# EAGLE board Controller-Board_Rack-PDU_2.1 (EAGLE 9.2.1)
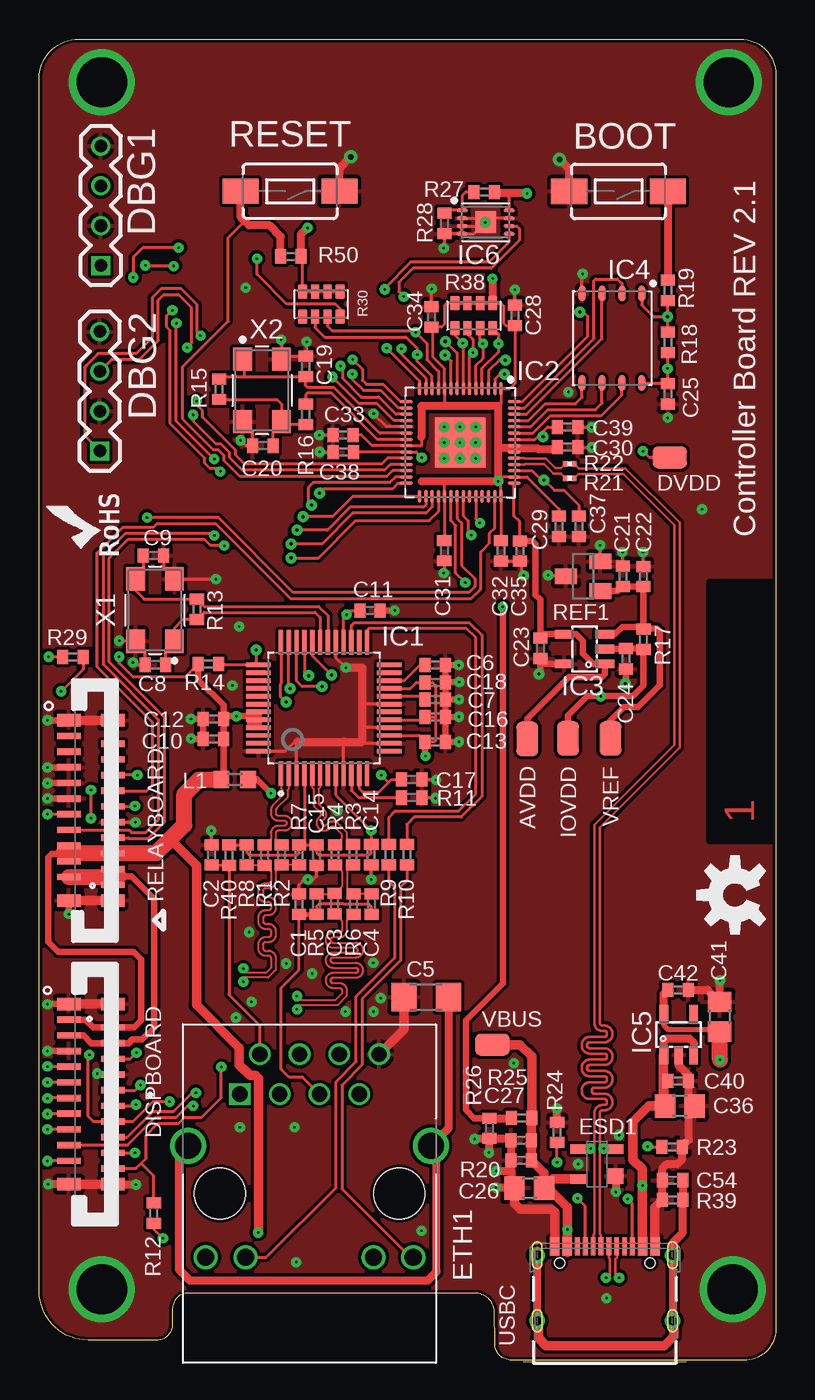
[diagram p2: board, top side]
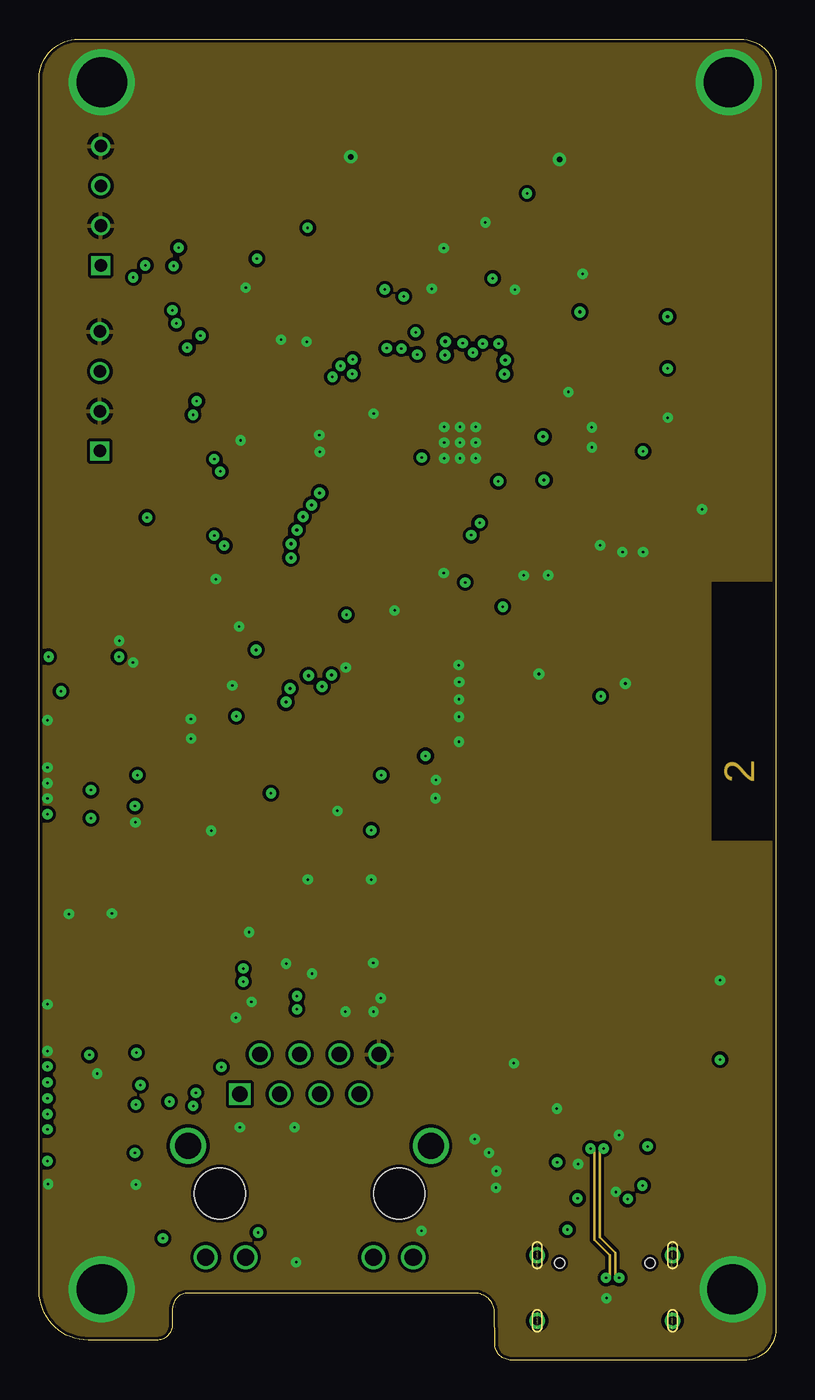
[diagram p3: board, inner layer Route2]
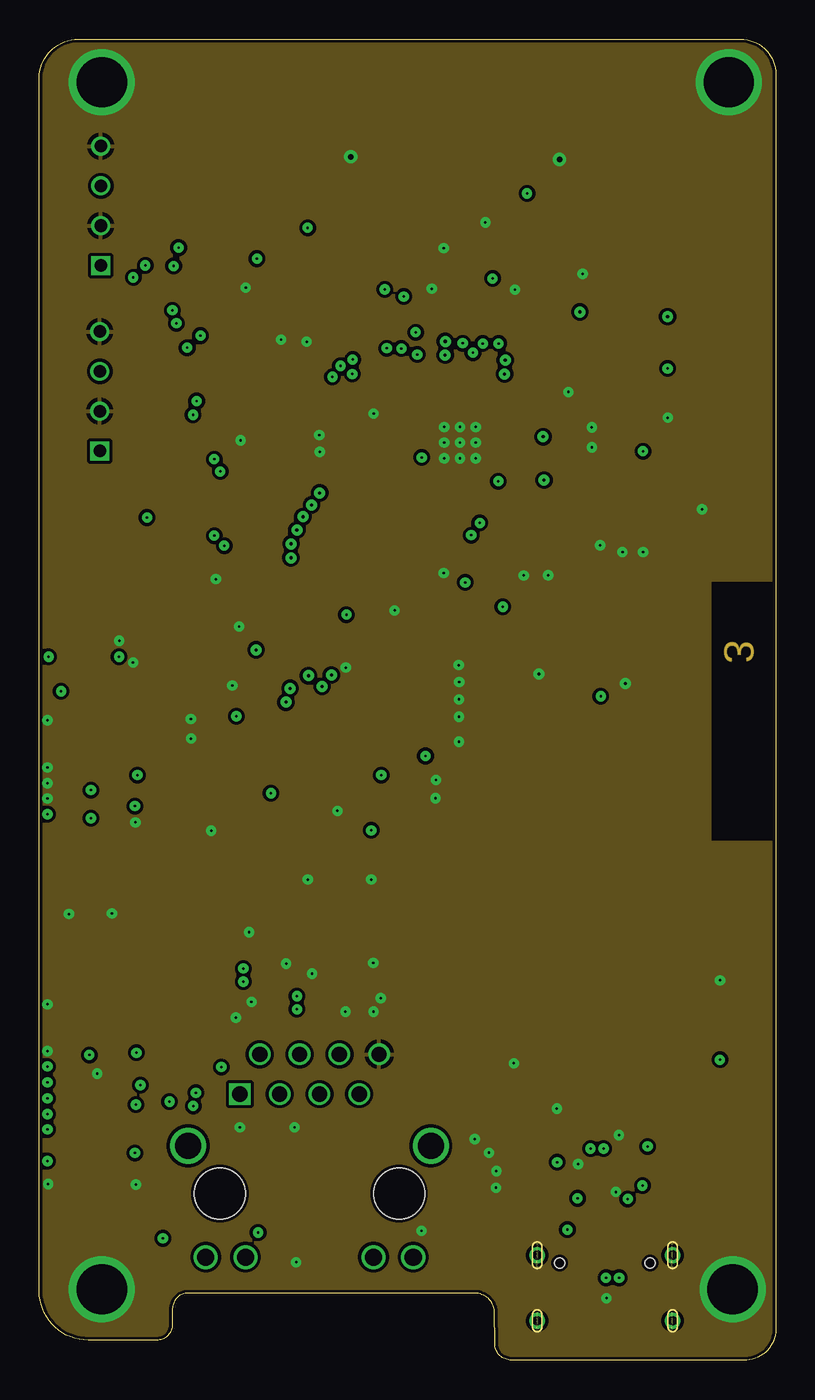
[diagram p4: board, inner layer Route15]
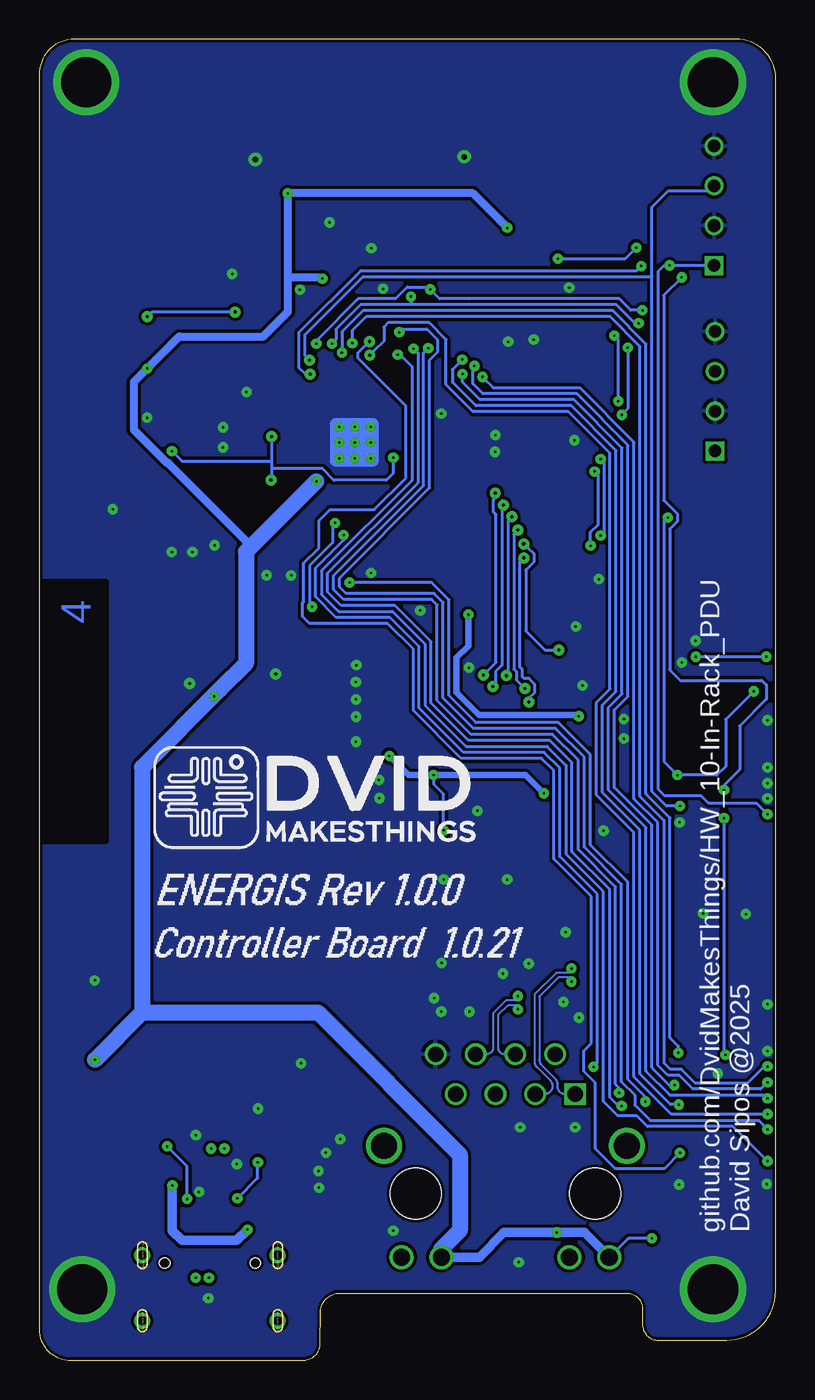
[diagram p5: board, bottom side, seen from below]

Size 47 x 84.28 mm. Coordinates in mm from the lower left corner, seen from the top.
Outline: 0,4.42 0,81.77 arc-90 2.51,84.28 44.76,84.28 arc-90 47,82.04 47,1.78 arc-90 44.77,0.01 30.13,0.01 arc-90 29.07,1.07 29.06,3.11 arc90 27.69,4.28 9.5,4.28 arc90 8.5,3.28 8.5,2.28 arc-90 7.5,1.28 3.13,1.28 arc-90 0,4.42
Copper layers (1+2*15+16): Top 0.035mm / dielectric 0.15mm / Route2 0.0175mm / dielectric 1.265mm / Route15 0.0175mm / dielectric 0.15mm / Bottom 0.035mm
Design rules "4layers *": minimum track width 3.5mil, minimum drill 0.15mm, track to track 3.5mil, track to pad 3.5mil, pad to pad 3.5mil, via to via 3.5mil, smd to smd 3.5mil, copper to edge 0.2mm, drill to drill 6mil, minimum pad ring 8mil, minimum via ring 0.25mm, stop-mask expansion 0.05mm, vias tented up to drill 16mil, thermal gap 10mil
Net classes: 0 default: width 0.2 mm, drill 0.15 mm, clearance 0.178 mm; 1 100R_DIFFPAIR: width 0.121 mm, drill 0.15 mm, clearance 0.191 mm; 2 90R_DIFFPAIR: width 0.155 mm, drill 0.15 mm, clearance 0.191 mm

## Footprints (pad centres in the part's own frame; a part is rotated, then mirrored left to right if it is on the bottom)
TP = smd 2.2 x 1.4: TP 0,0
TACTILE-SWITCH-1101NE = smd 2.3 x 1.6: 1 -3.15,0; 2 3.15,0
C0402 = smd 0.7 x 0.9: 1 -0.65,0; 2 0.65,0
C1206 = smd 1.6 x 1.803: 1 -1.422,0; 2 1.422,0
0805 = smd 1.3 x 1.5: 1 -0.95,0; 2 0.95,0
0402 = smd 0.7 x 0.9: 1 -0.65,0; 2 0.65,0
1X4 = drill 0.8 square: 1 0,3.81 | drill 0.8: 2 0,1.27; 3 0,-1.27; 4 0,-3.81
687320124422 = smd 0.4 x 1.5: 1 -4.75,-1.4; 2 -4.25,1.4; 3 -3.75,-1.4; 4 -3.25,1.4; 5 -2.75,-1.4; 6 -2.25,1.4; 7 -1.75,-1.4; 8 -1.25,1.4; 9 -0.75,-1.4; 10 -0.25,1.4; 11 0.25,-1.4; 12 0.75,1.4; 13 1.25,-1.4; 14 1.75,1.4; 15 2.25,-1.4; 16 2.75,1.4; 17 3.25,-1.4; 18 3.75,1.4; 19 4.25,-1.4; 20 4.75,1.4 | smd 0.8 x 1.5: Z1 -5.75,-1.4; Z2 -5.75,1.4; Z3 5.75,-1.4; Z4 5.75,1.4
SOT143 = smd 1 x 1: 1 -0.75,-1.2 | smd 0.6 x 1: 2 0.95,-1.2; 3 0.95,1.2; 4 -0.95,1.2
RJ45-CAT5 = drill 0.97 square: 1 -4.445,6.35 | drill 0.97: 2 -3.175,8.89; 3 -1.905,6.35; 4 -0.635,8.89; 5 0.635,6.35; 6 1.905,8.89; 7 3.175,6.35; 8 4.445,8.89 | drill 1.1: 9 -6.625,-4.06; 10 -4.085,-4.06; 11 4.085,-4.06; 12 6.625,-4.06 | drill 1.65: S1 -7.745,3.05; S2 7.745,3.05 | hole 3.25: 5.715,0; -5.715,0
LQFP48 = smd 1.56 x 0.28: 1 -4.18,2.75; 2 -4.18,2.25; 3 -4.18,1.75; 4 -4.18,1.25; 5 -4.18,0.75; 6 -4.18,0.25; 7 -4.18,-0.25; 8 -4.18,-0.75; 9 -4.18,-1.25; 10 -4.18,-1.75; 11 -4.18,-2.25; 12 -4.18,-2.75; 25 4.18,-2.75; 26 4.18,-2.25; 27 4.18,-1.75; 28 4.18,-1.25; 29 4.18,-0.75; 30 4.18,-0.25; 31 4.18,0.25; 32 4.18,0.75; 33 4.18,1.25; 34 4.18,1.75; 35 4.18,2.25; 36 4.18,2.75 | smd 0.28 x 1.56: 13 -2.75,-4.18; 14 -2.25,-4.18; 15 -1.75,-4.18; 16 -1.25,-4.18; 17 -0.75,-4.18; 18 -0.25,-4.18; 19 0.25,-4.18; 20 0.75,-4.18; 21 1.25,-4.18; 22 1.75,-4.18; 23 2.25,-4.18; 24 2.75,-4.18; 37 2.75,4.18; 38 2.25,4.18; 39 1.75,4.18; 40 1.25,4.18; 41 0.75,4.18; 42 0.25,4.18; 43 -0.25,4.18; 44 -0.75,4.18; 45 -1.25,4.18; 46 -1.75,4.18; 47 -2.25,4.18; 48 -2.75,4.18
QFN40P700X700X100-57T510 = smd 0.837 x 0.22: 1 -3.437,2.6; 2 -3.437,2.2; 3 -3.437,1.8; 4 -3.437,1.4; 5 -3.437,1; 6 -3.437,0.6; 7 -3.437,0.2; 8 -3.437,-0.2; 9 -3.437,-0.6; 10 -3.437,-1; 11 -3.437,-1.4; 12 -3.437,-1.8; 13 -3.437,-2.2; 14 -3.437,-2.6; 29 3.437,-2.6; 30 3.437,-2.2; 31 3.437,-1.8; 32 3.437,-1.4; 33 3.437,-1; 34 3.437,-0.6; 35 3.437,-0.2; 36 3.437,0.2; 37 3.437,0.6; 38 3.437,1; 39 3.437,1.4; 40 3.437,1.8; 41 3.437,2.2; 42 3.437,2.6 | smd 0.22 x 0.837: 15 -2.6,-3.437; 16 -2.2,-3.437; 17 -1.8,-3.437; 18 -1.4,-3.437; 19 -1,-3.437; 20 -0.6,-3.437; 21 -0.2,-3.437; 22 0.2,-3.437; 23 0.6,-3.437; 24 1,-3.437; 25 1.4,-3.437; 26 1.8,-3.437; 27 2.2,-3.437; 28 2.6,-3.437; 43 2.6,3.437; 44 2.2,3.437; 45 1.8,3.437; 46 1.4,3.437; 47 1,3.437; 48 0.6,3.437; 49 0.2,3.437; 50 -0.2,3.437; 51 -0.6,3.437; 52 -1,3.437; 53 -1.4,3.437; 54 -1.8,3.437; 55 -2.2,3.437; 56 -2.6,3.437 | smd 3.2 x 3.2: 57 0,0
SOT23-5 = smd 0.55 x 1.2: 1 -0.95,-1.3; 2 0,-1.3; 3 0.95,-1.3; 4 0.95,1.3; 5 -0.95,1.3
SON127P600X500X75-8N = smd 1.012 x 0.432: 1 -2.85,1.905; 2 -2.85,0.635; 3 -2.85,-0.635; 4 -2.85,-1.905; 5 2.85,-1.905; 6 2.85,-0.635; 7 2.85,0.635; 8 2.85,1.905
SON50P300X200X50-9T130X140N = smd 0.711 x 0.27: 1 -1.501,0.75; 2 -1.501,0.25; 3 -1.501,-0.25; 4 -1.501,-0.75; 5 1.501,-0.75; 6 1.501,-0.25; 7 1.501,0.25; 8 1.501,0.75 | smd 1.3 x 1.4: 9 0,0
0603 = smd 1 x 1.1: 1 -0.85,0; 2 0.85,0
R0201 = smd 0.34 x 0.35: 1 -0.275,0; 2 0.275,0
742C083103JP = smd 0.59 x 0.92: 1 -1.2,-0.8; 2 -0.4,-0.8; 3 0.4,-0.8; 4 1.2,-0.8; 5 1.2,0.8; 6 0.4,0.8; 7 -0.4,0.8; 8 -1.2,0.8
SOT23 = smd 1 x 1.4: 1 -0.95,-1.1; 2 0.95,-1.1; 3 0,1.1
629722000214 = smd 0.3 x 1.15: A1 -3.35,4.745; A4 -2.55,4.745; A5 -1.25,4.745; A6 -0.25,4.745; A7 0.25,4.745; A8 1.25,4.745; A9 2.55,4.745; A12 3.35,4.745; B1 3.05,4.745; B4 2.25,4.745; B5 1.75,4.745; B6 0.75,4.745; B7 -0.75,4.745; B8 -1.75,4.745; B9 -2.25,4.745; B12 -3.05,4.745 | drill 0.6 pad 1: S1 -4.32,4.18; S2 4.32,4.18; S3 -4.32,0; S4 4.32,0 | hole 0.65: -2.89,3.68; 2.89,3.68
OSCCC500X320X130 = smd 1.487 x 1.187: 1 -1.988,-1.238; 2 1.988,-1.238; 3 1.988,1.238; 4 -1.988,1.238

## Placement (x,y rotation side)
AVDD  TP  [TP]  31.15,39.64 270 top
BOOT  RS032G05A3SM-SPST-MOMENTARY-SWSMD-1101NE  [TACTILE-SWITCH-1101NE]  36.97,74.57 180 top
C1  100nF  [C0402]  16.58,29.1 90 top
C2  22nF  [C0402]  10.99,32.24 90 top
C3  6.8nF  [C0402]  18.86,29.12 270 top
C4  6.8nF  [C0402]  20.06,29.1 270 top
C5  C1206C102KGRACTM  [C1206]  24.7,23.17 0 top
C6  100nF  [C0402]  25.27,44.35 0 top
C7  4.7uF  [C0402]  25.27,42.16 0 top
C8  18pF  [C0402]  7.42,44.37 180 top
C9  18pF  [C0402]  7.29,51.33 0 top
C10  100nF  [C0402]  11.12,39.64 180 top
C11  100nF  [C0402]  21.11,47.83 0 top
C12  100nF  [C0402]  11.12,40.92 180 top
C13  100nF  [C0402]  25.27,39.45 0 top
C14  100nF  [C0402]  21.19,32.25 270 top
C15  100nF  [C0402]  17.71,32.23 270 top
C16  100nF  [C0402]  25.27,41.05 0 top
C17  100nF  [C0402]  23.77,37.05 0 top
C18  100nF  [C0402]  25.27,43.25 0 top
C19  15pF  [C0402]  17.01,63.4 90 top
C20  15pF  [C0402]  14.27,58.34 180 top
C21  1uF  [C0402]  37.24,50.02 90 top
C22  100nF  [C0402]  38.55,50 90 top
C23  100nF  [C0402]  31.98,45.42 270 top
C24  100nF  [C0402]  37.43,44.75 270 top
C25  100nF  [C0402]  40.11,61.65 270 top
C26  10uF  [0805]  31.27,10.99 180 top
C27  100nF  [0402]  30.77,14.04 180 top
C28  100nF  [C0402]  30.36,66.66 90 top
C29  100nF  [C0402]  33.17,53.2 270 top
C30  100nF  [C0402]  33.73,58.26 0 top
C31  100nF  [C0402]  25.85,51.66 270 top
C32  100nF  [C0402]  29.47,51.65 270 top
C33  100nF  [C0402]  19.39,59.02 180 top
C34  100nF  [C0402]  25.04,66.56 90 top
C35  100nF  [C0402]  30.67,51.63 270 top
C36  10uF  [0805]  40.88,16.22 0 top
C37  100nF  [C0402]  34.44,53.21 270 top
C38  100nF  [C0402]  19.4,57.93 180 top
C39  100nF  [C0402]  33.72,59.54 0 top
C40  100nF  [0402]  40.78,17.82 0 top
C41  10uF  [0805]  43.43,21.91 90 top
C42  100nF  [0402]  40.78,23.64 0 top
C54  4.7nF  [0402]  40.42,11.5 180 top
DBG1  [1X4]  3.93,73.66 180 top
DBG2  [1X4]  3.87,61.82 180 top
DISPBOARD  687320124422  [687320124422]  3.3,16.98 270 top
DVDD  TP  [TP]  40.23,57.6 0 top
ESD1  SP0503BAHTG-ES  [SOT143]  35.59,12.51 90 top
ETH1  SI-60118-F  [RJ45-CAT5]  17.25,10.63 0 top
IC1  W5500  [LQFP48]  18.17,41.61 90 top
IC2  RP2040  [QFN40P700X700X100-57T510]  26.87,58.55 270 top
IC3  MCP6001R  [SOT23-5]  34.8,45.38 90 top
IC4  W25Q128JVPIQ  [SON127P600X500X75-8N]  36.55,65.2 270 top
IC5  MIC5504-3.3YM5-TR  [SOT23-5]  40.81,20.77 0 top
IC6  CAT24C512HU5IGT3  [SON50P300X200X50-9T130X140N]  28.49,72.61 0 top
IOVDD  TP  [TP]  33.75,39.68 270 top
L1  BLM18EG221TN1D  [0603]  12.48,37.05 0 top
R1  3.3R  [0402]  14.38,32.23 270 top
R2  3.3R  [0402]  15.48,32.24 270 top
R3  3.3R  [0402]  20.03,32.26 270 top
R4  3.3R  [0402]  18.88,32.24 270 top
R5  49.9R  [C0402]  17.7,29.1 90 top
R6  49.9R  [C0402]  21.2,29.1 90 top
R7  49.9R  [0402]  16.59,32.24 90 top
R8  49.9R  [0402]  13.24,32.24 90 top
R9  470R  [0402]  22.31,32.25 270 top
R10  470R  [0402]  23.46,32.25 270 top
R11  12.4K 1%  [0402]  23.77,35.89 180 top
R12  10K  [0402]  7.32,9.4 270 top
R13  1M  [0402]  10.06,47.91 270 top
R14  4.7K  [0402]  10.8,44.41 180 top
R15  0R  [0402]  11.48,61.95 270 top
R16  1K  [0402]  17.01,60.35 90 top
R17  4.7K  [0402]  38.57,46.01 270 top
R18  DNI  [0402]  40.11,64.95 270 top
R19  1K  [0402]  40.11,68.25 270 top
R20  2.2K 1%  [0402]  30.77,12.77 180 top
R21  27R  [R0201]  33.85,56.28 180 top
R22  27R  [R0201]  33.85,57.19 180 top
R23  5.1K  [0402]  40.38,13.63 0 top
R24  5.1K  [0402]  33.05,14.54 90 top
R25  10K  [0402]  30.79,15.46 180 top
R26  10K  [0402]  28.73,14.8 270 top
R27  NC  [0402]  28.41,74.53 0 top
R28  4.7K  [0402]  25.86,72.53 90 top
R29  10K  [0402]  2.15,44.86 180 top
R30  4D03WGJ0332T5E  [742C083103JP]  18,67.38 180 top
R38  4D03WGJ0332T5E  [742C083103JP]  27.74,66.65 0 top
R39  1M  [0402]  40.42,10.23 180 top
R40  470R  [0402]  12.12,32.23 90 top
R50  10K  [0402]  16.06,70.42 180 top
REF1  LM4040BXX  [SOT23]  34.72,50.02 90 top
RELAYBOARD  687320124422  [687320124422]  3.3,35.08 90 top
RESET  RS032G05A3SM-SPST-MOMENTARY-SWSMD-1101NE  [TACTILE-SWITCH-1101NE]  16.01,74.58 180 top
U$1  [4-LAYER]  46.58,33.14 90 top
U$2  [OSHW-LOGO-M]  44.4,29.68 90 top
U$3  [ROHS_LOGO_0.18_IN]  5.2,51.18 90 top
USBC  USB-TYPE-C-018  [629722000214]  36.1,2.52 0 top
VBUS  TP  [TP]  28.91,20.13 0 top
VREF  TP  [TP]  36.45,39.68 270 top
X1  XC53M4-25.000-F18NJDTL  [OSCCC500X320X130]  7.39,47.86 90 top
X2  K5A1200015304P  [OSCCC500X320X130]  14.22,61.88 270 top

## Tracks (layer width: path | path; a pad name or v marks a point on that pad's centre or on a via)
!ACT
  Top 0.203: IC1.27 19.92,46.89 20.1,47.06 27.44,47.06 28.24,46.26 28.24,35.97 26.92,34.65 23.92,34.65 23.46,34.19 R10.1
!LINK
  Top 0.203: R9.1 22.31,34.64 22.7,35.03 26.76,35.03 27.86,36.13 27.86,46.1 27.28,46.68 21.02,46.68 20.92,46.59 IC1.25
!QSPI_SS  (via drill 0.2)
  Top 0.2: IC2.56 30.83,61.15 35.02,65.35 35.02,66.58 34.72,66.88 v34.5,66.88 | v40.1,66.58 R18.1 | IC4.1 38.45,67.33 39.2,66.58 v40.1,66.58 | R19.2 v40.1,66.58
  Bottom 0.2: v34.5,66.88 39.8,66.88 v40.1,66.58
!W5500_CS  (via drill 0.2 pad 0.3)
  Top 0.2: IC1.32 17.42,44.95 v18.65,43.72 | v17.9,55.33 18.15,55.58 22.53,55.58 22.9,55.95 IC2.28
  Bottom 0.2: v18.65,43.72 17.84,44.53 17.84,53.96 18.04,54.16 18.04,54.88 17.9,55.02 v17.9,55.33
!W5500_INT  (via drill 0.2 pad 0.3)
  Top 0.2: IC2.32 25.47,54.15 24.88,53.56 20.18,53.56 17.82,51.2 v16.07,51.2 | IC1.36 15.42,43.17 15.38,43.13 15.38,42.36 v15.75,41.99
  Bottom 0.2: v15.75,41.99 15.75,42.24 15.38,42.61 15.38,43.13 15.75,43.5 16.07,43.5 16.18,43.6 16.18,44.09 16.33,44.24 16.33,50.94 v16.07,51.2
!W5500_RST  (via drill 0.2 pad 0.3)
  Top 0.2: IC1.37 13.82,44.36 | 13.82,44.36 11.5,44.36 R14.1 | IC2.31 25.06,55.1 25.06,54.43 24.67,54.04 20,54.04 18.05,52.09 v16.08,52.09 | v13.84,45.32 13.84,44.38 13.82,44.36
  Bottom 0.2: v16.08,52.09 15.82,51.82 15.81,51.82 15.44,51.46 15.44,50.94 15.95,50.43 15.95,46.53 14.74,45.32 v13.84,45.32
+1V1  (via drill 0.15, 0.2)
  Top 0.2: IC2.23 20.07,57.95 C38.1 | IC2.50 31.65,58.75 31.99,59.09 | 31.99,59.09 32.44,59.54 C39.1 | 31.99,59.09 v32.16,58.92 | 31.43,56.75 32.04,56.14 | v32.22,56.16 32.87,55.5 33.5,55.5 34.44,54.57 C37.1
  Top 0.203: IC2.45 31.43,56.75 | 32.04,56.14 32.06,56.16 v32.22,56.16 | IC2.23 24.05,57.95 v24.41,57.59 | DVDD.TP 38.93,57.6 v38.53,58
  Bottom 0.203: v32.16,58.92 32.16,57.35 | 32.16,57.35 32.16,56.91 | 32.16,56.91 32.16,56.21 v32.22,56.16 | v24.41,57.59 24.41,56.58 24.84,56.15 28.2,56.15 28.93,56.88 32.13,56.88 32.16,56.91 | v38.53,58 37.88,57.35 32.16,57.35
+3V3  (via drill 0.15)
  Top 0.2: IC2.33 25.87,52.33 C31.1 | IC2.42 C32.1 | IC2.22 21.25,58.35 20.58,59.02 C33.1 | IC2.1 30.03,61.99 30.38,62.34 30.38,65.98 C28.1 29.8,66.01 29.63,66.17 29.63,67.27 29.45,67.45 R38.5 R38.6 R38.7 R38.8 26.04,67.45 25.85,67.26 25.85,66.09 25.67,65.91 C34.1 25.13,65.83 25.13,64 25.87,63.26 IC2.10 | IC4.8 40.05,62.35 C25.1 v40.11,63.27 R18.2 | IC2.49 30.31,58.18 IC2.48 | R12.2 7.32,8.36 v7.9,7.78 | R29.2 0.62,44.86 v0.6,44.88 | R14.2 9.32,43.58 6,43.58 5.1,44.48 v5.1,44.88 | R30.1 R30.2 R30.3 R30.4 16.8,70.33 R50.1 | 31.13,56.35 33.17,54.31 C29.1
  Top 0.203: 31.13,56.35 IC2.44 29.33,56.35 29.3,56.38 | IC2.42 29.47,55.91 v29.3,56.08 | IC2.33 25.87,56.05 25.9,56.08 | IC2.22 24.37,58.35 24.4,58.38 24.4,58.91 24.39,58.92 | IC2.1 29.47,61.05 29.3,60.88 | IC2.10 25.87,60.95 25.8,60.88 | IC1.43 13.99,41.24 | 13.99,41.09 IC1.44 13.99,40.63 13.99,40.54 IC1.45 | IC1.28 19.42,47.39 v19.6,47.56 | C11.1 19.87,47.83 v19.61,47.57 | R27.2 29.64,74.53 29.99,74.19 IC6.8
  Top 0.305: IC5.5 39.86,21.37 40.11,21.13 43.27,21.13 C41.1 | RELAYBOARD.5 4.72,32.35 7.47,32.35
  Top 0.406: IC3.2 37.4,45.38 C24.1 38.52,45.4 R17.2 38.57,43.05 37.88,42.37 v35.84,42.37 34.98,42.37 33.75,41.13 IOVDD.TP | L1.1 11.77,37.19 C10.1 C12.1 | 13.99,41.09 13.46,41.09 | 13.46,41.09 v12.58,41.09 11.94,41.09 C12.1 | 13.99,40.63 13.58,40.63 13.48,40.53 13.46,40.55 13.46,41.09 | 13.99,41.09 13.99,40.54 | 13.99,41.09 13.99,41.24 | C12.1 11.77,41.79 10.15,43.41 R14.2 | v19.6,47.56 v19.61,47.57 | DISPBOARD.1 2.94,21.73 3.44,21.23 DISPBOARD.2 6.05,21.23 6.51,21.69 6.51,25.57 6.03,26.05 1.23,26.05 0.59,26.69 0.59,32.09 0.81,32.31 1.5,32.31 1.54,32.35 | RELAYBOARD.6 1.54,32.47 1.54,32.35 | 1.54,32.35 1.54,32.19 RELAYBOARD.4
  Top 0.508: C30.1 32.96,58.14 31.84,58.14 31.79,58.18 30.31,58.18 29.3,58.18 | 29.3,56.38 29.3,58.18 | 29.3,58.18 29.3,60.88 25.8,60.88 24.4,60.88 24.39,60.87 24.39,58.92 | 24.4,56.08 25.9,56.08 v29.3,56.08 29.3,56.28 | IC5.5 39.86,23.37 C42.1 | v31.13,74.44 29.14,74.44 R27.2 | R50.1 16.71,71.83 v17.13,72.25 | R38.5 28.94,69 v28.93,69.01
  Top 0.61: 8.37,33.25 10.04,31.57 10.04,22.66 12.77,19.93 12.77,18.86 13.45,18.18 13.81,18.18 14,17.99 14,8.18 v13.97,8.15
  Top 1.016: 1.54,32.35 7.47,32.35 8.37,33.25 9.26,34.14 9.26,36.11 10.2,37.05 L1.1 | v43.44,19.17 C41.1
  Bottom 0.2: v7.9,7.78 9.41,7.78 ETH1.9 | v0.6,44.88 v5.1,44.88
  Bottom 0.406: v19.61,47.57 19.61,45.57 20.36,44.82 20.36,42.6 18.93,41.17 12.66,41.17 v12.58,41.09 | v35.84,42.37 35.84,42.42 35.47,42.79
  Bottom 0.508: 33.8,51.58 33.8,52.27 38.77,57.24 38.84,57.24 40.97,59.37 40.97,62.41 v40.11,63.27 38.06,65.32 32.7,65.32 31.13,66.89 31.13,69.07 | 31.13,69.07 v31.13,74.44 19.32,74.44 v17.13,72.25 | v28.93,69.01 28.99,69.07 31.13,69.07
  Bottom 0.61: ETH1.11 18.92,6.57 17.34,8.15 v13.97,8.15 12.21,8.15 ETH1.9
  Bottom 1.016: v29.3,56.08 33.8,51.58 33.8,44.46 35.47,42.79 40.43,37.83 40.43,22.18 | 40.43,22.18 v43.44,19.17 | 40.43,22.18 29.21,22.18 20.15,13.12 20.15,8.29 21.34,7.11 ETH1.11
+3V3_A  (via drill 0.15)
  Top 0.2: R40.2 13.22,32.88 R8.2 13.24,32.4 13.41,32.23 16.46,32.23 16.59,32.36 R7.2 | R7.2 C15.1 17.71,32.37 17.84,32.24 19.45,32.24 19.46,32.25 20.6,32.25 20.61,32.24 21.04,32.24 21.19,32.39 C14.1 v21.19,33.81 18.92,36.08 IC1.8 | IC1.4 16.92,33.23 R7.2
  Top 0.203: C17.1 22.48,37.05 22.34,36.91 | 22.34,36.91 21.7,36.27 20.64,36.27 20.42,36.49 IC1.11 | IC1.17 24.43,40.86 C16.1 25.29,41.05 | IC1.15 24.21,39.86 C13.1 25.21,39.45 25.29,39.53 25.29,41.05 | IC1.21 23.68,42.86 24.07,43.25 C18.1 25.1,43.25 25.29,43.06 25.29,41.05 | v21.83,37.34 22.26,36.91 22.34,36.91
  Top 0.406: C13.1 24.62,38.58 v24.65,38.55 | L1.2 13.91,37.05 v14.79,36.17
  Bottom 0.203: v21.83,37.34 21.83,36.76 21.19,36.12 v21.19,33.81
  Bottom 0.406: v24.65,38.55 23.43,37.34 v21.83,37.34 21.81,37.36 15.97,37.36 v14.79,36.17
+5V
  Top 0.254: RELAYBOARD.3 4.7,30.86 RELAYBOARD.1
  Top 0.406: DISPBOARD.3 2.83,20.73 3.33,20.23 DISPBOARD.4 5.71,20.23 5.94,20.46 6.57,20.46 7.33,21.22 7.33,29.44 5.91,30.86 5.21,30.86
  Top 0.813: 4.7,30.86 5.21,30.86
  Top 1.016: RELAYBOARD.2 4.67,30.83 4.7,30.86
+12V_MEA
  Top 0.203: RELAYBOARD.13 6.87,36.33 7.24,36.7 7.24,40.7 3.7,44.24 3.7,51.5 5.35,53.15 7.3,53.15 7.53,53.38 11.26,53.38 16.03,48.61 27.57,48.61 28.18,49.21 28.18,51.58 28.74,52.14 28.74,52.76 29.07,53.09 IC2.41
ADC_V_USB  (via drill 0.15)
  Top 0.203: IC2.38 27.87,53.67 v28.12,53.42
  Top 0.406: v29.59,48.08 29.59,24.04 27.24,21.69 27.24,15.96 27.75,15.45 R26.1
  Top 0.508: R26.1 30.13,15.45 R25.2
  Bottom 0.203: v28.12,53.42 28.27,53.27 28.27,52.17 29.75,50.69 29.75,48.24 v29.59,48.08
AVDD
  Top 0.2: C35.1 30.67,53.51 30.31,53.88 IC2.43
  Top 0.406: AVDD.TP 31.15,40.93 33.8,43.58 35.9,43.58 36.1,43.78 IC3.1 35.35,44.43 34.7,45.08 34.7,45.88 34.25,46.33 IC3.4 32.24,46.33 C23.1 31.98,48.54 31.68,48.83 31.68,52.06 31.47,52.28 C35.1
CC1  (via drill 0.15)
  Top 0.203: USBC.A5 34.85,9.83 v34.35,10.33 | v33.05,12.63 R24.1
  Bottom 0.203: v34.35,10.33 33.05,11.63 v33.05,12.63
CC2  (via drill 0.15)
  Top 0.203: USBC.B5 37.85,10 v37.56,10.29 | v38.83,13.64 38.85,13.63 R23.1
  Bottom 0.203: v37.56,10.29 37.56,12.37 v38.83,13.64
CHASSIS
  Top 0.508: C5.2 26.12,14.81 ETH1.S2 25.36,13.32 25.36,5.65 24.81,5.1 9.61,5.1 8.91,5.8 8.91,13.09 ETH1.S1
DP_N  (via drill 0.15)
  Top 0.155: USBC.B7 35.35,8 35.43,8.07 35.43,13.5 | R21.1 34.4,56.55 37.27,56.55 40.53,53.29 40.53,39.24 35.43,34.14 35.43,21.53 arc90 35.95,21.01 36.06,21.01 arc-90 36.24,20.84 36.24,20.81 arc-90 36.06,20.64 35.13,20.64 arc90 34.62,20.12 34.62,20.08 arc90 35.13,19.57 36.06,19.57 arc-90 36.24,19.39 36.24,19.36 arc-90 36.06,19.19 35.13,19.19 arc90 34.62,18.67 34.62,18.63 arc90 35.13,18.12 36.06,18.12 arc-90 36.24,17.94 36.24,17.91 arc-90 36.06,17.74 35.13,17.74 arc90 34.62,17.22 34.62,17.19 arc90 35.13,16.67 36.06,16.67 arc-90 36.24,16.49 36.24,16.46 arc-90 36.06,16.29 35.95,16.29 arc90 35.43,15.77 35.43,14.07 35.43,13.57 35.43,13.5 | USBC.A7 36.35,6.53 36.42,6.46 36.42,5.26 v36.17,5.26 | ESD1.3 35.14,13.46 v35.18,13.5 35.43,13.5
  Route2 0.155: v36.17,5.26 36.42,5.26 36.42,6.71 35.43,7.7 35.43,13.5 v35.18,13.5
DP_P  (via drill 0.15)
  Top 0.155: USBC.A6 35.85,8 35.77,8.07 35.77,13.51 | R22.1 34.42,56.9 37.41,56.9 40.87,53.43 40.87,39.1 35.77,34 35.77,21.53 arc90 35.95,21.36 36.06,21.36 arc-90 36.58,20.84 36.58,20.81 arc-90 36.06,20.29 35.13,20.29 arc90 34.96,20.12 34.96,20.08 arc90 35.13,19.91 36.06,19.91 arc-90 36.58,19.39 36.58,19.36 arc-90 36.06,18.84 35.13,18.84 arc90 34.96,18.67 34.96,18.63 arc90 35.13,18.46 36.06,18.46 arc-90 36.58,17.94 36.58,17.91 arc-90 36.06,17.39 35.43,17.39 arc90 35.26,17.22 35.26,17.19 arc90 35.43,17.01 36.06,17.01 arc-90 36.58,16.49 36.58,16.46 arc-90 36.06,15.94 35.95,15.94 arc90 35.77,15.77 35.77,13.57 35.77,13.51 | USBC.B6 36.85,6.55 36.76,6.46 36.76,5.26 v37.01,5.26 | ESD1.2 36.06,13.46 v36.02,13.5 35.78,13.5 35.77,13.51
  Route2 0.155: v37.01,5.26 36.76,5.26 36.76,6.85 35.77,7.84 35.77,13.5 v36.02,13.5
GND  (via drill 0.15, 0.2, 0.35, 3.2 pad 4)
  Top 0.2: C8.2 6.76,45.27 X1.4 | C9.2 7.93,50.55 X1.2 | C20.2 13.62,59.25 X2.2 | X2.4 15.64,64.05 C19.2 | C1.2 16.58,30.34 16.91,30.67 v17.14,30.67 17.49,30.67 17.71,30.89 C15.2 | C14.2 v21.19,30.67 | C2.2 10.99,33.78 v10.98,33.79
  Top 0.203: USBC.A1 32.9,7.27 USBC.B12 | USBC.B1 39.3,7.27 USBC.A12 | IC1.29 18.92,44.84 v19.57,44.19 | IC1.14 20.72,39.36 20.62,39.46 | IC1.16 20.74,40.36 20.62,40.48 | IC1.19 20.68,41.86 20.62,41.92 | IC1.9 19.42,39.46 19.46,39.46 19.42,39.43 | IC1.3 16.42,39.21 | 16.42,39.21 16.42,39.59 15.7,38.86 IC1.48 | RELAYBOARD.9 v6.13,34.33 v6.14,34.32 | IC2.19 22.16,59.55 21.34,60.37 v21.34,60.4 | 16.42,39.21 16.48,39.27 16.48,39.46 | X1.2 11.26,49.85 v11.28,49.83 | X1.4 5.14,45.88 v5.11,45.9 | C8.2 6.13,44.37 v5.99,44.51 | REF1.2 35.82,51.98 v35.8,51.99 | C21.2 37.24,51.55 v37.22,51.56 | C22.2 v38.55,51.55 v38.54,51.56 | REF1.3 32.54,50.02 v32.48,50.08 | C32.2 30.65,51 C35.2 30.76,50.89 30.76,50.23 v30.92,50.07 | C31.2 25.85,50.26 v25.82,50.23 | C20.2 13.2,58.34 v12.85,58.69 | C33.2 v17.88,59.02 | v17.91,57.95 18.73,57.95 C38.2 | v17.07,64.98 17.07,64.11 C19.2 | v15.44,65.11 15.46,65.09 X2.4 | C34.2 v25.05,68.36 | C28.2 v30.36,68.3 | IC4.4 34.65,69.27 v34.68,69.3 | R28.1 25.86,71.86 | 25.86,71.86 25.86,71 v25.81,70.95 | IC6.4 25.86,71.86 | IC6.4 IC6.3 | IC6.3 IC6.2 28.2,72.86 v28.47,72.59 28.24,72.36 | IC6.3 28.24,72.36 | IC6.4 27.74,71.86 28.24,72.36 | IC6.7 28.74,72.86 IC6.9 | C30.2 34.4,58.24 v35.27,58.24 | C39.2 35.25,59.54 v35.26,59.52 | C17.2 25.29,37.05 v25.32,37.02 | R11.1 25.26,35.89 v25.29,35.86 | DISPBOARD.8 3.76,18.23 v3.7,18.29
  Top 0.406: IC3.5 32.32,44.43 C23.2 31.98,43.86 v31.9,43.78 | C24.2 37.43,43.21 v37.4,43.18 | C18.2 C7.2 | C7.2 C16.2 | C18.2 C6.2 v26.77,44.35 | C18.2 25.94,43.27 v26.8,43.27 | C7.2 v26.79,42.16 | C16.2 v26.78,41.05 v26.79,41.06 | C16.2 C13.2 26.77,39.44 v26.79,39.46 | v9.69,39.66 9.71,39.64 C10.2 C12.2 v9.69,40.92 v9.68,40.91 | v22.68,47.84 v22.67,47.83 C11.2 | DISPBOARD.5 v0.54,19.73 v0.53,19.72 | DISPBOARD.Z1 0.55,22.73 v0.53,22.71 | RELAYBOARD.12 v0.54,35.83 v0.53,35.84 | RELAYBOARD.14 0.55,36.83 v0.53,36.81 | RELAYBOARD.16 v0.54,37.83 v0.53,37.82 | RELAYBOARD.Z4 v0.53,40.83 | RELAYBOARD.Z1 4.7,28.57 v4.64,28.51 | RELAYBOARD.Z2 v1.9,28.47
  Top 0.508: C42.2 42.65,23.64 C41.2 43.43,24.22 v43.45,24.24 | IC5.2 40.81,18.81 41.43,18.19 C40.2 41.43,16.62 C36.2 41.47,15.86 41.47,14.06 R23.2 41.03,12.82 40.73,12.52 40.06,12.52 39.77,12.23 C54.2 R39.2 | 30.12,12.05 R20.2 C27.2 30,14.15 R26.2 28.7,14.11 | 30.12,12.05 30.12,11.2 C26.2 29.17,10.99 v29.15,11.01 | R24.2 33.05,16.03 v33.03,16.05 | 28.7,14.11 v28.7,13.24 | ESD1.1 v36.79,10.75 v36.8,10.74 | 30.12,12.05 29.19,12.05 v29.17,12.07 | 28.7,14.11 v27.79,14.11 | 19.46,39.46 20.62,39.46 20.62,40.48 20.62,41.92 20.62,44.19 v19.57,44.19 | DISPBOARD.Z4 6.15,11.23 v6.17,11.21 | DISPBOARD.Z3 v0.58,11.23 v0.57,11.24 | 16.48,39.46 19.42,39.46 | RESET.1 19.16,76.06 v19.88,76.78 | BOOT.2 33.82,75.99 v33.2,76.61
  Top 0.61: C26.2 30.32,10.01 30.7,9.63 32.7,9.63 32.9,9.43 32.9,7.27 | R39.2 39.3,9.76 39.3,7.27 | C5.1 23.28,21.11 ETH1.8 | RELAYBOARD.Z2 RELAYBOARD.Z1 | RELAYBOARD.Z4 RELAYBOARD.Z3 | DISPBOARD.Z1 DISPBOARD.Z2 | DISPBOARD.Z3 DISPBOARD.Z4
  Bottom 0.813: 25.73,58.03 25.73,57.39 28.05,57.39 28.05,59.73 25.73,59.73 25.73,58.03 | 25.73,58.03 27.69,58.03 27.69,58.75 26.11,58.75 26.11,59.32 27.57,59.32
  other vias: 17.41,24.66 21.32,25.35 15.76,25.3 13.4,27.31 13.55,22.86 19.54,22.24 21.34,22.24 21.8,23.1 40.11,60.13 26.85,58.54 25.85,58.54 25.85,59.54 26.85,59.54 27.85,59.54 27.85,58.54 27.85,57.54 26.85,57.54 25.85,57.54 4,4.53 44.25,4.53 4,81.53 44,81.53 12.8,14.86 16.3,14.86 12.55,21.86 19.03,35.05 12.76,46.81 12.33,43.05 33.77,61.77 13.18,68.43 30.29,18.95 34.39,12.52 42.3,54.29 16.4,6.26 24.4,8.26 37,14.36 36.2,3.96
  pour Route2 (isolate 0.203): -5.46,85.03 47.5,85.03 47.5,49.78 42.75,49.78 42.75,33.03 47.5,33.03 47.5,32.78 47.57,32.71 47.48,-0.24 -5.46,-0.24
  pour Top (isolate 0.203): -5.81,84.93 47.5,84.93 47.5,49.78 42.75,49.78 42.75,33.03 47.57,33.03 47.55,-0.29 -5.81,-0.29
  pour Route15 (isolate 0.203): -4.55,84.98 47.36,84.98 47.5,49.78 42.75,49.78 42.75,33.03 47.57,33.03 47.57,-0.21 -4.55,-0.21
  pour Bottom (isolate 0.203): -5.28,84.93 47.46,84.93 47.5,49.78 42.75,49.78 42.75,33.03 47.57,33.03 47.57,-0.2 -5.28,-0.2
I2C0_SCL  (via drill 0.15)
  Top 0.2: R38.1 26.54,65.39 26.96,64.97 27.07,64.86 IC2.7
  Top 0.203: DISPBOARD.7 v0.54,18.73 v0.53,18.74 | v27.02,64.89 26.96,64.95 26.96,64.97
  Bottom 0.2: v0.53,18.74 0.74,18.74 1.7,17.78
  Bottom 0.203: v27.02,64.89 27.02,65.68 26.13,66.57 10.56,66.57 8.66,64.68 8.66,35.98 7.13,34.45 7.13,18.97 6.72,18.56 6.2,18.56 6.01,18.56 5.12,17.68 1.8,17.68 1.7,17.78
I2C0_SDA  (via drill 0.15)
  Top 0.2: 27.34,65.47 R38.2 | IC2.6 27.47,64.08
  Top 0.203: DISPBOARD.6 5.82,19.23 v6.21,19.62 | 27.47,64.08 v27.68,64.29 27.68,65.13 27.34,65.47
  Bottom 0.203: v6.21,19.62 6.21,20.04 6.75,20.58 6.75,34.6 8.28,36.13 8.28,64.83 10.4,66.95 26.34,66.95 27.68,65.62 v27.68,64.29
I2C1_SCL  (via drill 0.15)
  Top 0.2: R38.3 28.14,65.11 28.31,64.94 v28.31,64.86 28.31,63.92 27.87,63.48 IC2.5
  Top 0.203: RELAYBOARD.8 5.72,33.83 5.89,33.66 6.79,33.66 7.62,34.49 7.62,40.86 4.1,44.38 4.1,51.34 5.53,52.77 11.01,52.77 v11.17,52.61 | v11.17,57.49 8.75,59.91 v8.75,66.16 | IC6.6 30.47,72.36 30.65,72.18 30.65,71.46 28.85,69.66 23.85,69.66 22.96,68.77 22.96,68.17 v23.27,67.86
  Bottom 0.203: v11.17,52.61 10.95,52.84 10.95,57.27 v11.17,57.49 | v8.75,66.16 8.99,66.16 10.17,67.33 23.25,67.33 | v28.31,64.86 28.06,65.11 28.06,65.77 26.5,67.33 23.25,67.33 | v23.27,67.86 23.27,67.35 23.25,67.33
I2C1_SDA  (via drill 0.15)
  Top 0.2: R38.4 29.31,65.48 v29.31,64.86 29.31,64.32 28.27,63.28 IC2.4
  Top 0.203: RELAYBOARD.7 5.68,33.33 5.73,33.28 6.95,33.28 8,34.34 8,41.02 4.48,44.54 4.48,51.18 5.69,52.39 10.54,52.39 10.92,52.01 11.78,52.01 v11.81,51.97 | v11.55,56.7 11.37,56.89 10.92,56.89 10.57,57.24 10.57,57.56 8.37,59.75 8.37,65.69 8.15,65.91 8.15,66.63 v8.5,66.99 | IC6.5 29.99,71.34 28.69,70.04 23.69,70.04 22.06,68.41 v22.06,68.33 v22.05,68.32
  Bottom 0.203: v11.81,51.97 11.81,52.83 11.33,53.31 11.33,56.48 v11.55,56.7 | v8.5,66.99 9.25,66.99 9.99,67.72 19.55,67.72 19.56,67.71 21.44,67.71 v22.05,68.32 22.19,68.47 23.52,68.47 24.26,67.72 26.65,67.72 29.31,65.06 v29.31,64.86
KEY_0  (via drill 0.15)
  Top 0.203: DISPBOARD.12 6.1,16.23 v6.18,16.31 | IC2.15 23.06,61.15 21.94,62.27 20.87,62.27 20.62,62.52 20.62,63.23 v20,63.85
  Bottom 0.203: v6.18,16.31 6.71,16.31 8.68,18.28 8.68,33.83 11.06,36.22 11.06,41.81 10.19,42.68 10.19,58.05 13.04,60.9 19.13,60.9 20.63,62.4 20.63,63.22 v20,63.85
KEY_1  (via drill 0.15)
  Top 0.203: DISPBOARD.11 0.55,16.73 v0.53,16.71 | IC2.16 22.92,60.75 21.79,61.88 20.68,61.88 19.98,62.59 v19.98,62.92
  Bottom 0.203: v0.53,16.71 0.73,16.92 6.76,16.92 8.28,18.44 8.28,33.98 10.68,36.37 10.68,41.65 9.8,42.52 9.8,58.21 12.88,61.28 18.87,61.28 19.98,62.39 v19.98,62.92
KEY_2  (via drill 0.15)
  Top 0.203: DISPBOARD.10 6.14,17.23 v6.46,17.55 | IC2.17 22.78,60.35 21.67,61.46 20.55,61.46 19.35,62.66 19.35,63.44 v19.23,63.44
  Bottom 0.203: v6.46,17.55 6.79,17.55 7.9,18.67 7.9,34.14 10.29,36.53 10.29,41.49 9.42,42.36 9.42,58.39 12.7,61.66 18.69,61.66 19.33,62.3 19.33,63.44 v19.23,63.44
KEY_3  (via drill 0.15)
  Top 0.203: DISPBOARD.9 v0.53,17.73 | v18.71,62.74 20.4,61.05 21.54,61.05 22.64,59.95 IC2.18
  Bottom 0.2: v0.53,17.73 0.96,17.3 5.28,17.3 5.71,17.73
  Bottom 0.203: v18.71,62.74 18.02,62.04 12.51,62.04 9.04,58.58 9.04,35.82 7.52,34.3 7.52,18.82 6.88,18.18 6.17,18.18 5.71,17.73
LCD_BL  (via drill 0.15, 0.2)
  Top 0.2: v25.9,64.13 26.28,63.75 IC2.9
  Top 0.203: DISPBOARD.13 0.56,15.73 v0.53,15.7
  Bottom 0.203: v0.53,15.7 6.66,15.7 9.06,18.1 9.06,33.68 11.44,36.06 11.44,41.96 10.57,42.84 10.57,57.86 13.22,60.52 19.32,60.52 21.03,62.23 21.03,65.12 22.1,66.19 24.74,66.19 25.01,65.92 25.01,65.02 25.65,64.37 25.66,64.37 v25.9,64.13
LCD_CS  (via drill 0.15)
  Top 0.2: v24.12,64.16 24.12,64.56 23.4,65.28 18.2,65.28 17.6,65.88 R30.6
  Top 0.203: IC2.12 25.06,62.8 24.12,63.74 v24.12,64.16 | DISPBOARD.19 0.55,12.73 v0.53,12.71
  Bottom 0.203: v24.12,64.16 23.99,64.16 23.22,63.4 23.22,56.14 28.98,50.38 28.98,48.87 27.89,47.78 24.46,47.78 22.37,45.69 22.37,41.77 19.76,39.17 14.59,39.17 13.38,37.96 13.38,32.29 11,29.91 11,16.52 10.07,15.6 8.87,15.6 8.19,14.92 2.73,14.92 v0.53,12.71
LCD_DC  (via drill 0.15, 0.2)
  Top 0.2: v25.91,65 25.92,65 26.67,64.26 IC2.8
  Top 0.203: DISPBOARD.18 v6.11,13.23
  Bottom 0.203: v6.11,13.23 7.12,12.22 10.23,12.22 11.51,13.5 11.51,17.71 12.23,18.43 12.23,19.75 11.76,20.22 11.76,29.59 14.15,31.98 14.15,37.62 14.94,38.4 20.08,38.4 23.13,41.46 23.13,45.37 24.77,47.02 29.75,47.02 30.19,47.45 30.19,48.33 30.13,48.4 30.13,50.85 29.15,51.83 29.15,53.57 28.44,54.27 25.63,54.27 23.6,56.29 23.6,60.89 26.64,63.92 26.64,64.28 26.16,64.75 v25.91,65
LCD_MISO  (via drill 0.15)
  Top 0.2: 25.47,63.12 IC2.11 | R30.7 18.4,65.98 18.7,65.68 23.92,65.68 v24.02,65.59
  Top 0.203: DISPBOARD.15 v0.53,14.73 | v24.02,65.59 24.75,64.86 24.75,63.83 25.46,63.12 25.47,63.12
  Bottom 0.203: v0.53,14.73 1.09,15.3 8.01,15.3 8.99,16.28 8.99,16.93 9.84,17.77 9.84,30.36 12.22,32.74 12.22,38.48 14.05,40.31 19.29,40.31 21.22,42.24 21.22,48.35 21.8,48.92 27.42,48.92 27.84,49.34 27.84,49.9 22.08,55.66 22.08,63.81 21.55,64.34 21.55,65.09 22.25,65.79 23.82,65.79 v24.02,65.59
LCD_MOSI  (via drill 0.15)
  Top 0.203: DISPBOARD.16 5.62,14.23 7.28,15.89 8.58,15.89 9.76,17.07 v10,17.07 | v22.18,64.57 24.27,62.48 IC2.14
  Bottom 0.203: v10,17.07 10,17.37 10.23,17.61 10.23,30.21 12.6,32.59 12.6,38.29 14.24,39.93 19.45,39.93 21.61,42.09 21.61,48.19 21.96,48.54 27.58,48.54 28.22,49.18 28.22,50.06 22.46,55.82 22.46,64.29 v22.18,64.57
LCD_RES  (via drill 0.15)
  Top 0.2: R30.8 19.2,67.08 18.9,67.38 15.8,67.38 13.9,69.28 v13.9,70.28 | v8.9,70.98 6.6,70.98 6,70.38 v6,69.08 | v3.3,36.38 v3.3,34.58 | v3.2,19.48 3.1,19.38 3.1,15.58 3.45,15.23 DISPBOARD.14
  Top 0.203: DISPBOARD.14 5.99,15.23 7.26,16.51 v8.32,16.51 | v27.19,49.62 26.58,50.23 26.58,53.26 26.27,53.57 IC2.34
  Bottom 0.2: v13.9,70.28 9.6,70.28 v8.9,70.98 | v6,69.08 7.14,67.94 7.14,54.87 6.28,54.01 6.28,53.51 6.76,53.04 6.76,44.04 6.1,43.38 0.9,43.38 0.6,43.08 0.6,42.18 2.3,40.48 2.3,37.68 3.3,36.68 v3.3,36.38 | v3.2,19.48 3.3,19.58 v3.3,34.58
  Bottom 0.203: v8.32,16.51 8.32,16.8 9.45,17.93 9.45,30.51 11.83,32.89 11.83,38.64 13.88,40.69 19.13,40.69 20.84,42.4 20.84,48.51 21.96,49.62 v27.19,49.62
LCD_SCLK  (via drill 0.15)
  Top 0.203: DISPBOARD.17 5.66,13.73 7.42,15.49 8.73,15.49 9.46,16.23 v9.83,16.23 | v23.11,64.55 23.11,64.21 24.67,62.65 IC2.13
  Bottom 0.203: v9.83,16.23 10.04,16.23 10.61,16.8 10.61,30.06 12.99,32.44 12.99,38.12 14.42,39.55 19.6,39.55 21.99,41.93 21.99,45.85 24.3,48.16 27.74,48.16 28.6,49.03 28.6,50.22 22.84,55.98 22.84,64.27 v23.11,64.55
MCP_DSP_RST  (via drill 0.15)
  Top 0.2: R12.1 7.32,11.76 6.51,12.57
  Top 0.203: DISPBOARD.20 6.17,12.23 6.51,12.57 6.83,12.89 6.83,14.36 7.57,15.11 8.89,15.11 9.28,15.5 10.38,15.5 11.62,16.75 v11.62,18.71 | v27.57,52.64 27.36,52.85 27.36,53.58 27.07,53.87 IC2.36
  Bottom 0.203: v11.62,18.71 11.38,18.96 11.38,29.75 13.77,32.14 13.77,37.78 14.78,38.78 19.92,38.78 22.75,41.61 22.75,45.53 24.61,47.4 28.05,47.4 29.36,48.71 29.36,50.53 27.57,52.33 v27.57,52.64
MCP_REL_RST  (via drill 0.15)
  Top 0.2: R29.1 2.8,44.08 v1.4,42.68
  Top 0.203: IC2.35 26.67,53.71 26.96,53.42 26.96,50.71 27.79,49.87 27.79,49.37 27.41,48.99 16.21,48.99 11.44,53.76 v6.88,53.76 | v6.27,37.33 RELAYBOARD.15
  Bottom 0.2: v1.4,42.68 3.2,40.88 3.2,37.88 3.75,37.33 v6.27,37.33
  Bottom 0.203: v6.88,53.76 7.14,53.51 7.14,38.2 v6.27,37.33
N$1
  Top 0.203: IC1.10 19.92,36.35 20.38,35.89 R11.2
N$2
  Top 0.203: ETH1.10 14.49,6.57 18.93,11.01 18.93,17.76 20.23,19.06 20.23,23.2 22.69,25.66 22.69,30.21 22.31,30.59 R9.2
N$3
  Top 0.203: R10.2 23.46,30.59 23.07,30.2 23.07,25.5 20.61,23.04 20.61,18.85 19.31,17.55 19.31,10.95 23.69,6.57 ETH1.12
N$4
  Top 0.203: IC1.22 23.31,43.36 24.3,44.35 C6.1
N$5
  Top 0.203: IC1.20 24.42,42.36 C7.1
N$7
  Top 0.2: IC1.30 18.42,47.5 17.83,48.09 10.54,48.09 R13.1 6.69,48.56 6.16,49.09 X1.3 6.63,50.33 C9.1
N$14
  Top 0.2: R16.1 15.64,59.7 15.55,59.8 | 15.55,59.8 15.48,59.87 | 15.48,59.87 X2.3 15.46,61.02 15.17,61.3 R15.2 | 15.12,59.52 15.48,59.87 | C20.1 14.92,59.17 15.55,59.8
N$17
  Top 0.2: IC2.26 22.53,56.75 22.18,56.4 17.11,56.4
  Top 0.203: 17.11,56.4 12.8,56.4 11.78,57.43 11.78,57.74 11.42,58.1 11.11,58.1 9.13,60.07 9.13,63.36 12.06,66.29 12.06,71.63 13.12,72.68
  Top 0.508: R50.2 15.41,71.69 14.69,72.41 13.38,72.41 13.12,72.68 12.86,72.93 RESET.2
N$23
  Top 0.203: R28.2 26.04,73.36 IC6.1 26.98,74.3 27.22,74.53 R27.1
QSPI_SCLK
  Top 0.2: IC2.52 31.36,59.55 32.45,60.64 35.5,60.64 35.91,61.06 IC4.6
QSPI_SD0
  Top 0.2: IC2.53 31.23,59.95 32.3,61.02 34.23,61.02 34.65,61.44 IC4.5
QSPI_SD1
  Top 0.2: IC2.55 30.96,60.75 35.4,65.19 35.4,68.88 35.5,68.98 36.9,68.98 37.19,68.7 IC4.2
QSPI_SD2
  Top 0.2: IC2.54 31.1,60.35 35.91,65.17 IC4.3
QSPI_SD3
  Top 0.2: IC2.51 31.5,59.15 32.61,60.26 35.87,60.26 37.19,61.58 IC4.7
RCT
  Top 0.2: R6.1 21.2,28.94 21.05,29.09 19.45,29.09 19.43,29.11 18.27,29.11 17.86,29.11 17.7,28.95 R5.1
  Top 0.203: ETH1.5 16.82,18.05 15.96,18.05 15.45,18.56 15.45,23.76 16.58,24.89 C1.1
  Top 0.305: C1.1 R5.1
RD_N  (via drill 0.15)
  Top 0.121: C3.2 19.31,28.02 19.31,27.44 arc-90 19.16,27.28 18.75,27.28 arc90 18.28,26.82 18.28,26.8 arc90 18.75,26.33 20.17,26.33 arc-90 20.32,26.17 20.32,26.15 arc-90 20.17,26 18.75,26 arc90 18.28,25.53 18.28,25.51 arc90 18.75,25.04 20.19,25.04 arc-90 20.35,24.89 20.35,24.87 arc-90 20.19,24.71 18.75,24.71 arc90 18.28,24.25 18.28,24.23 arc90 18.75,23.76 19.16,23.76 arc-90 19.31,23.6 19.31,23.4 18.89,22.97 16.45,22.97 v16.45,23.23
  Bottom 0.121: v16.45,23.23 16.45,22.97 17.21,22.97 18.04,22.15 18.04,19.92 arc45 18.14,19.67 arc45 18.49,19.52 ETH1.6
RD_P  (via drill 0.15)
  Top 0.121: C4.2 19.63,28.02 19.63,27.44 arc-90 19.16,26.97 18.75,26.97 arc90 18.59,26.82 18.59,26.8 arc90 18.75,26.64 20.19,26.64 arc-90 20.66,26.17 20.66,26.15 arc-90 20.19,25.69 18.75,25.69 arc90 18.59,25.53 18.59,25.51 arc90 18.75,25.35 20.19,25.35 arc-90 20.66,24.89 20.66,24.87 arc-90 20.19,24.4 18.75,24.4 arc90 18.59,24.25 18.59,24.23 arc90 18.75,24.07 19.16,24.07 arc-90 19.63,23.6 19.63,23.26 19.02,22.66 16.45,22.66 v16.45,22.39
  Bottom 0.121: v16.45,22.39 16.45,22.66 17.09,22.66 17.71,22.03 17.71,19.92 arc-45 17.61,19.67 arc-45 17.26,19.52 ETH1.4
RDC_RD_N
  Top 0.121: R4.2 18.92,31.59 19.31,31.2 19.31,30.22 C3.1 18.84,29.75 R5.2
RDC_RD_P
  Top 0.121: R3.2 19.65,31.24 19.65,30.14 20.03,29.75 C4.1 R6.2
RP_XI
  Top 0.2: IC2.20 21.72,59.15 18.81,62.07 17.13,62.07 17.01,62.19 C19.1 13.09,62.75 | R15.1 11.62,62.75 13.09,62.75 | X2.1 13.09,63.76 13.09,62.75
RP_XO
  Top 0.2: IC2.21 21.59,58.75 18.65,61.69 17.1,61.69 17.01,61.61 R16.2
RX_RD_N
  Top 0.121: IC1.5 17.42,36.54 17.51,36.45 17.51,35.37 17.94,34.94 arc-90 17.94,34.72 17.84,34.62 arc90 17.84,33.95 17.86,33.93 arc90 18.52,33.93 18.63,34.03 arc-90 18.85,34.03 19.3,33.58 19.3,33.29 18.9,32.89 R4.1
RX_RD_P
  Top 0.121: IC1.6 17.92,36.55 17.83,36.45 17.83,35.5 18.16,35.16 arc-90 18.16,34.5 18.06,34.4 arc90 18.06,34.18 18.08,34.15 arc90 18.3,34.15 18.41,34.25 arc-90 19.07,34.25 19.62,33.71 19.62,33.29 arc-45 19.67,33.27 R3.1
SWCLK  (via drill 0.15)
  Top 0.2: IC2.24 22.23,57.55 21.85,57.18 17.23,57.18
  Top 0.203: 17.23,57.18 13.1,57.18 12.54,57.74 12.54,58.06 10.42,60.17 10.42,60.57 10.05,60.95 v10.05,61.19 | v10.29,65.37 10.07,65.6 10.07,67.35 9.05,68.37 7.79,68.37 7.22,67.8 7.22,65.25 6.19,64.23 3.75,64.23 2.99,63.46 2.99,63.44 2.9,63.35 2.9,58.98 DBG2.1
  Bottom 0.203: v10.05,61.19 10.05,65.12 v10.29,65.37
SWDIO  (via drill 0.15)
  Top 0.203: DBG2.3 4.62,63.84 6.38,63.84 7.6,65.06 7.6,67.64 7.95,67.99 8.89,67.99 9.69,67.19 9.69,64.85 v9.44,64.6 | v9.82,60.32 9.82,59.92 11.26,58.48 11.58,58.48 12.16,57.9 12.16,57.58 12.96,56.78 17.27,56.78 22.03,56.78 22.4,57.15 IC2.25
  Bottom 0.203: v9.44,64.6 9.44,60.7 v9.82,60.32
TCT
  Top 0.2: R40.1 11.01,31.58 C2.1
  Top 0.203: R40.1 12.12,23.32 14.07,21.36 ETH1.2
TD_N  (via drill 0.15)
  Top 0.121: v13.03,24.99 13.03,24.73 14.47,24.73 14.78,25.05 14.78,25.66 arc90 14.63,25.82 14.44,25.82 arc-90 13.97,26.29 13.97,26.52 arc-90 14.44,26.99 14.63,26.99 arc90 14.78,27.14 14.78,27.38 arc90 14.63,27.53 14.44,27.53 arc-90 13.97,28 13.97,28.23 arc-90 14.44,28.7 14.63,28.7 arc90 14.78,28.86 14.78,29.09 arc90 14.63,29.25 14.44,29.25 arc-90 13.97,29.72 13.97,29.95 arc-90 14.44,30.42 14.63,30.42 arc90 14.78,30.57 14.78,31.18 R1.2 R8.1
  Bottom 0.121: v13.03,24.99 13.03,24.73 14,24.73 15.4,23.34 15.4,19.07 arc-45 15.25,18.71 14.39,17.85 arc45 14.25,17.5 14.25,17.48 arc90 14.75,16.98 ETH1.3
TD_P  (via drill 0.15)
  Top 0.121: v13.03,24.15 13.03,24.42 14.61,24.42 15.1,24.9 15.1,25.66 arc90 14.63,26.13 14.44,26.13 arc-90 14.28,26.29 14.28,26.52 arc-90 14.44,26.68 14.63,26.68 arc90 15.1,27.14 15.1,27.38 arc90 14.63,27.84 14.46,27.84 arc-90 14.3,28 14.3,28.23 arc-90 14.46,28.39 14.63,28.39 arc90 15.1,28.86 15.1,29.09 arc90 14.63,29.56 14.44,29.56 arc-90 14.28,29.72 14.28,29.95 arc-90 14.44,30.11 14.63,30.11 arc90 15.1,30.57 15.1,31.2 R2.2 R7.1
  Bottom 0.121: v13.03,24.15 13.03,24.42 13.88,24.42 15.08,23.21 15.08,19.19 arc-45 14.94,18.84 14.08,17.98 arc45 13.93,17.63 13.93,17.48 arc-90 13.43,16.98 ETH1.1
TX_TD_N
  Top 0.121: IC1.1 15.42,36.47 15.52,36.37 15.52,36.03 14.97,35.47 arc45 14.78,35.03 14.78,34.91 arc90 15.25,34.44 15.64,34.44 arc-90 15.79,34.28 15.79,34.26 arc-90 15.64,34.1 15.25,34.1 arc90 14.78,33.63 14.78,33.29 R1.1
TX_TD_P
  Top 0.121: IC1.2 15.92,36.46 15.84,36.37 15.84,35.9 15.2,35.26 arc45 15.1,35.02 15.1,34.91 arc90 15.25,34.75 15.64,34.75 arc-90 16.11,34.28 16.11,34.26 arc-90 15.64,33.79 15.25,33.79 arc90 15.1,33.63 15.1,33.27 R2.1
UART0_RX  (via drill 0.15, 0.2)
  Top 0.2: IC2.2 29.07,62.58 29.41,62.92 v29.7,62.92
  Top 0.203: RELAYBOARD.10 v0.54,34.83 v0.53,34.84 | v8.58,69.81 6.8,69.81 v6.77,69.85
  Bottom 0.203: v0.53,34.84 1.23,35.54 4.3,35.54 4.79,36.03 7.1,36.03 7.52,36.45 7.52,69.45 7.13,69.85 v6.77,69.85 DBG1.1 | v29.7,62.92 30.01,62.92 30.4,63.31 30.4,65.6 26.48,69.52 8.87,69.52 v8.58,69.81
UART0_TX  (via drill 0.15, 0.2)
  Top 0.2: IC2.3 28.67,63.12 29.36,63.81 v29.74,63.81
  Top 0.203: RELAYBOARD.11 6.08,35.33 v6.11,35.36
  Bottom 0.203: v6.11,35.36 6.97,35.36 7.9,36.29 7.9,69.17 | DBG1.3 4.26,74.6 6.85,74.6 7.9,73.55 7.9,69.17 | v29.74,63.81 30.02,64.09 30.02,65.44 26.32,69.14 7.93,69.14 7.9,69.17
USB_BOOT
  Top 0.508: BOOT.1 40.12,68.91 R19.1
USB_DP_N
  Top 0.155: R21.2 33.3,56.56 32.81,56.56 32.2,57.17 31.01,57.17 30.99,57.15 IC2.46
USB_DP_P
  Top 0.155: R22.2 33.29,56.91 32.95,56.91 32.34,57.52 31.01,57.52 30.97,57.55 IC2.47
USB_SHIELD
  Top 0.508: C54.1 R39.1 41.07,8.14 40.42,7.49 USBC.S2 USBC.S4 | USBC.S3 USBC.S1
  Top 0.61: USBC.S3 31.85,2.45 31.85,1.42 32.34,0.93 39.89,0.93 40.49,1.53 40.49,2.45 USBC.S4
VBUS  (via drill 0.15)
  Top 0.203: USBC.A4 33.7,7.27 USBC.B9 | USBC.B4 38.5,7.27 USBC.A9
  Top 0.254: USBC.A9 38.48,7.44 | IC5.1 39.83,19.47 39.82,19.46
  Top 0.508: IC5.1 39.86,20.4 39.99,20.53 41.5,20.53 41.76,20.27 IC5.3
  Top 0.61: C26.1 32.46,10.99 33.7,9.75 v33.7,8.32 | C36.1 38.9,16.22 37.9,15.22 37.9,12.8 38.5,12.2 v38.5,11.15 38.5,7.27 | C26.1 32.22,11.96 R20.1 C27.1 31.42,15.43 R25.1 31.44,19.38 30.69,20.13 VBUS.TP | ESD1.4 32.8,11.56 C26.1 | C36.1 39.86,16.29 39.86,17.69 40,17.69 C40.1 | C36.1 39.82,16.33 39.82,19.46 | 33.7,6.89 33.7,7.27 v33.7,8.32 | v33.71,8.33 v33.7,8.32
  Bottom 0.61: v38.5,11.15 38.5,8.26 37.89,7.65 34.39,7.65 v33.71,8.33
VREF
  Top 0.406: REF1.1 36.94,49.07 C21.1 38.4,49.37 | 38.4,49.37 38.53,49.37 C22.1 | 38.57,46.68 R17.1 38.44,46.78 37.2,46.78 36.75,46.33 IC3.3 | 38.57,46.68 38.57,49.2 38.4,49.37 | VREF.TP 36.45,40.83 37.3,41.68 38.2,41.68 39.6,43.08 39.6,46.48 39.4,46.68 38.57,46.68
W5500_MISO  (via drill 0.2 pad 0.3)
  Top 0.2: IC2.27 22.73,56.35 22.36,55.98 17.47,55.98 17.16,55.67 17.16,54.79 v17.38,54.57 | v18.05,42.98 16.78,42.98 16.42,43.34 IC1.34
  Bottom 0.2: v17.38,54.57 17.46,54.49 17.46,44.35 17.88,43.93 17.88,43.15 v18.05,42.98
W5500_MOSI  (via drill 0.2 pad 0.3)
  Top 0.2: IC2.30 24.67,54.57 24.52,54.42 19.85,54.42 18.39,52.96 v16.44,52.96 | v16.01,42.87 15.92,42.95 IC1.35
  Bottom 0.2: v16.44,52.96 16.71,52.7 16.71,44.09 16.55,43.93 16.55,43.42 v16.01,42.87
W5500_SCK  (via drill 0.2 pad 0.3)
  Top 0.2: IC2.29 20.01,55.12 18.71,53.81 v16.84,53.81 v16.83,53.81 | IC1.33 16.92,43.93 v17.18,43.67
  Bottom 0.2: v16.83,53.81 17.08,53.56 17.08,43.77 v17.18,43.67
XO
  Top 0.2: R13.2 10.08,47.27 | 10.08,47.27 10.52,47.71 17.61,47.71 17.92,47.4 IC1.31 | C8.1 8.06,45.31 X1.1 8.63,46.71 9.19,47.27 10.08,47.27

## Text on the board
tPlace: Controller Board REV 2.1
tNames: R7 | R4
bNames: github.com/DvidMakesThings/HW_10-In-Rack_PDU / David Sipos @2025